# EAGLE schematic 00A-92 (EAGLE 6.3)
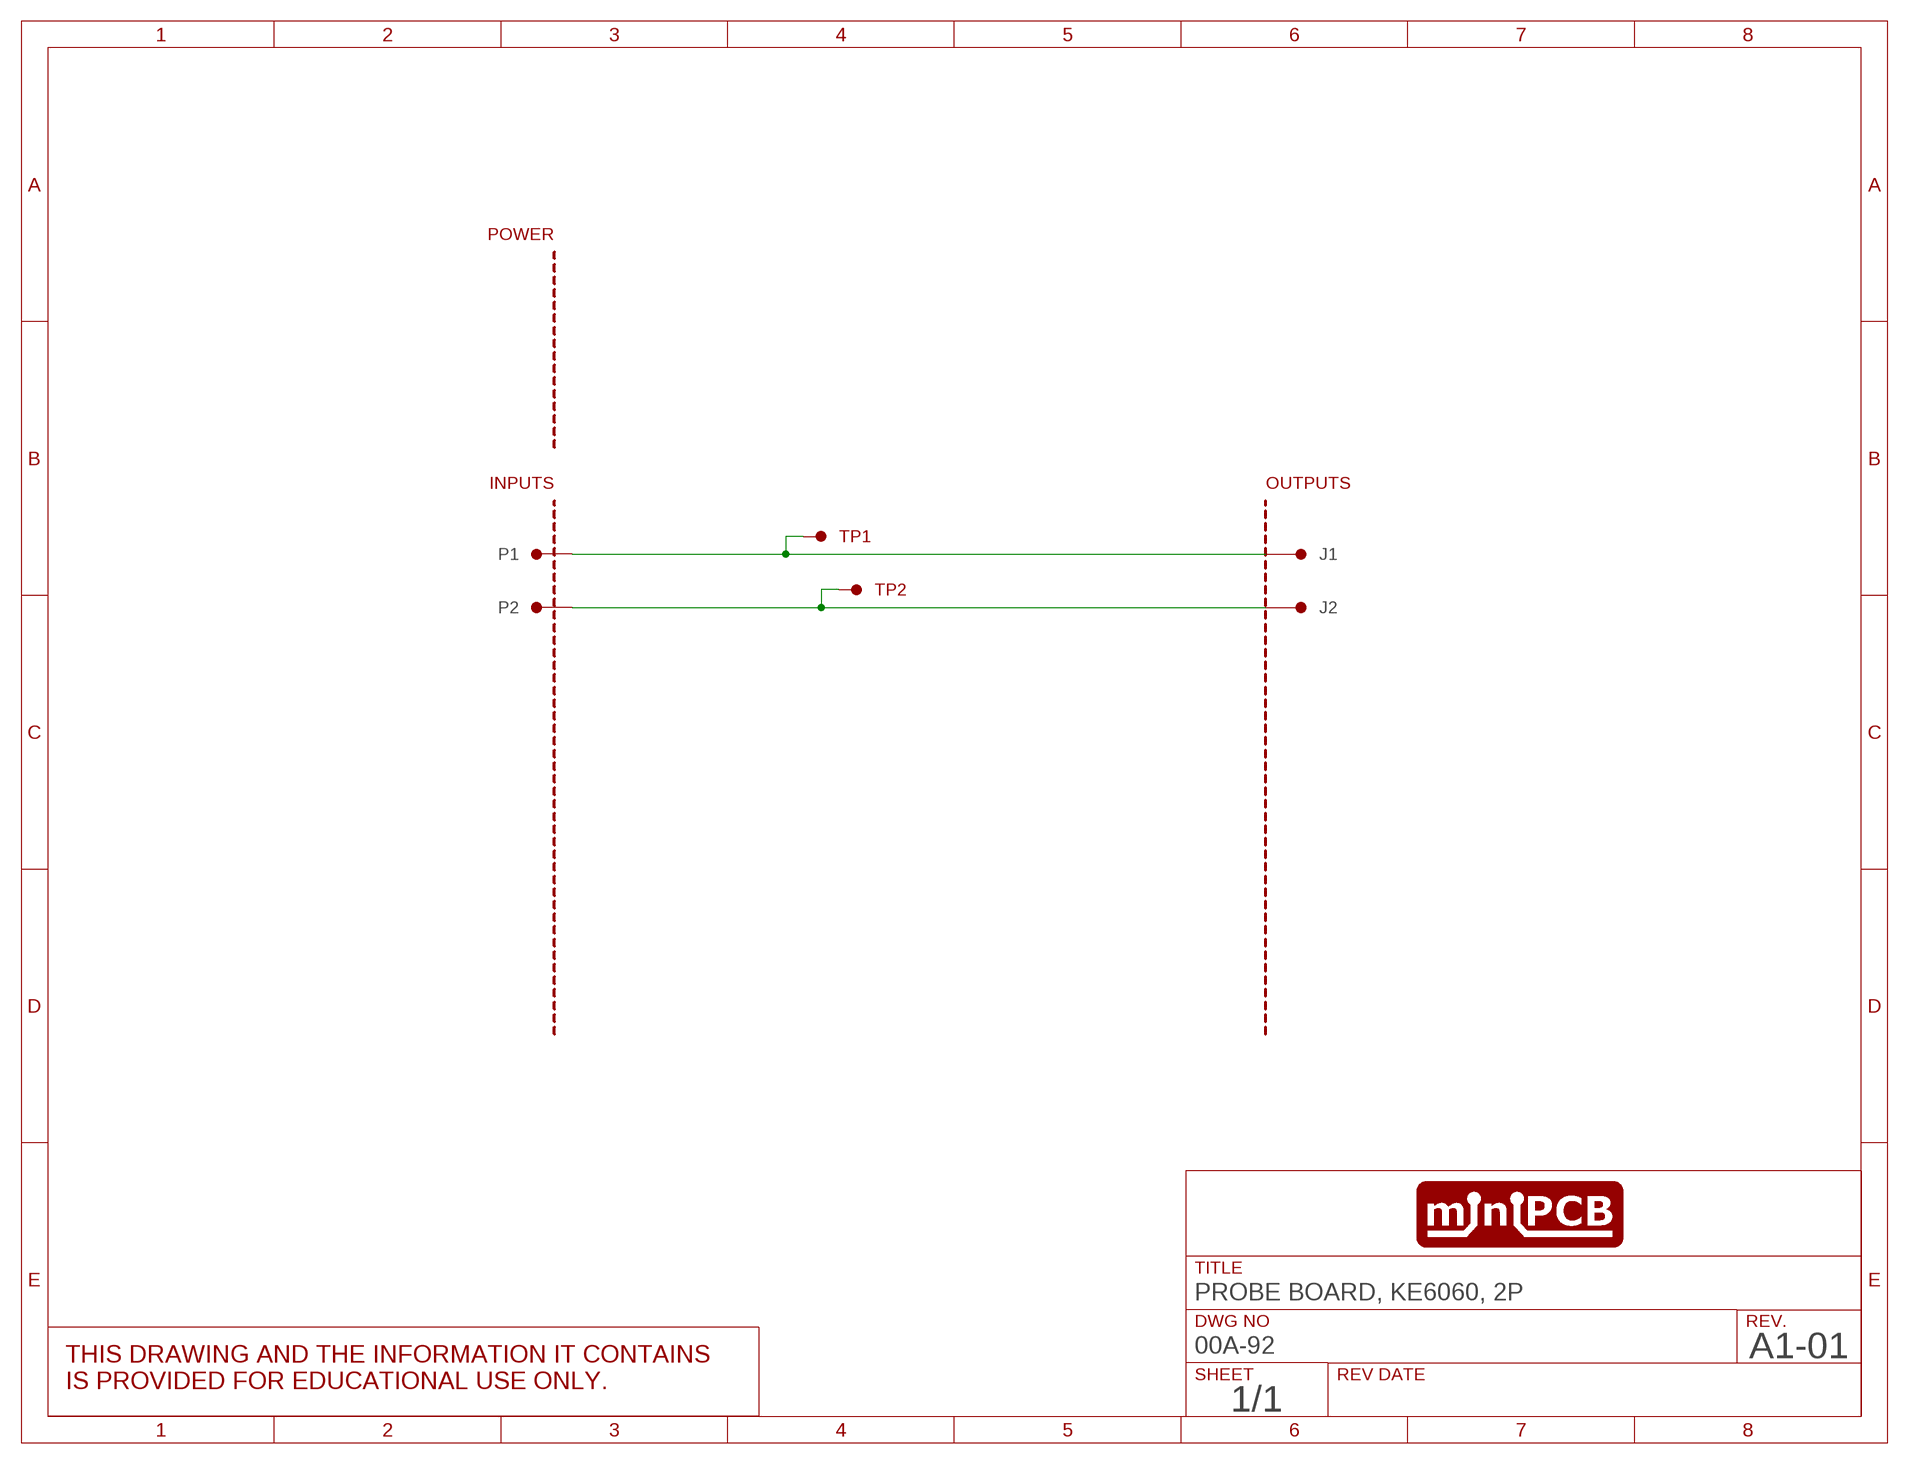
[diagram p0: schematic, sheet 1]
SHEET1 (SCHEMATIC): DWG_NO: 00A-92; REV: A1-01; TITLE: PROBE BOARD, KE6060, 2P

## Parts
J1  PINS_1KE6060  [PINS_1_KE6060]
J2  PINS_1KE6060  [PINS_1_KE6060]
P1  PINS_124AWG-NOTEXT  [PINS_1_1MM-NOTEXT]
P2  PINS_124AWG-NOTEXT  [PINS_1_1MM-NOTEXT]
PCB1  MINIPCB_0P00A-20X33  [MINIPCB_00A_20X33]
TP1  TESTPOINTKE5000-SMTEXT  [PINS_1_TESTPOINT_KE5000_NOTEXT]
TP2  TESTPOINTKE5000-SMTEXT  [PINS_1_TESTPOINT_KE5000_NOTEXT]

## Nets
N$1: J1.1 J1.2 P1.1 P1.2 TP1.1
N$3: J2.1 J2.2 P2.1 P2.2 TP2.1

## Library data of the parts
J1 J2 P1 P2 = minipcb:PINS_1
PCB1 = minipcb:MINIPCB_0P; PART_NUMBER: 00A-92-A1-01
TP1 TP2 = minipcb:TESTPOINT